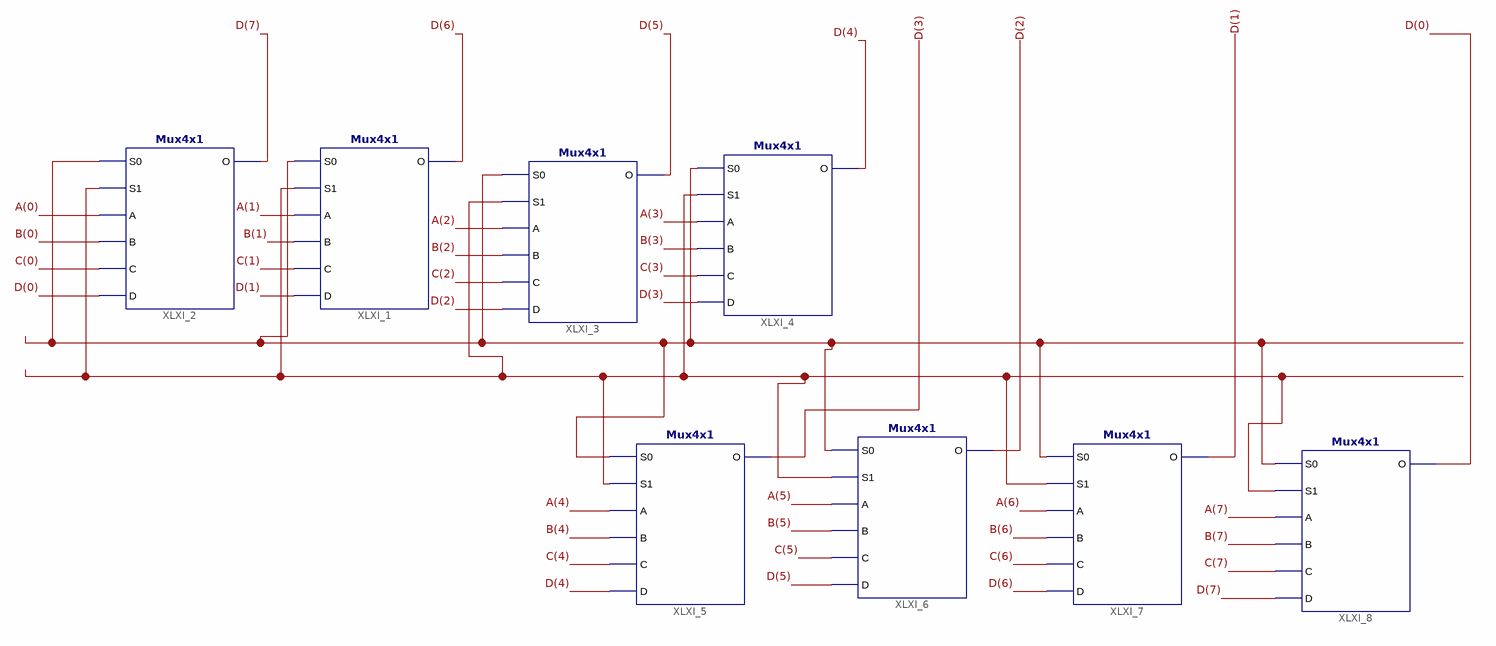
[diagram p0: schematic sheet 1]
// Xilinx ISE schematic commonbussystem.sch (artix7) as structural Verilog: 8 symbols, 0 ports
module commonbussystem (
);

  wire XLXN_25, XLXN_36;
  wire [7:0] A, B, C, D;

  Mux4x1 XLXI_1 (.S0(XLXN_25), .S1(XLXN_36), .A(A[1]), .B(B[1]), .C(C[1]), .D(D[1]), .O(D[6]));
  Mux4x1 XLXI_2 (.S0(XLXN_25), .S1(XLXN_36), .A(A[0]), .B(B[0]), .C(C[0]), .D(D[0]), .O(D[7]));
  Mux4x1 XLXI_3 (.S0(XLXN_25), .S1(XLXN_36), .A(A[2]), .B(B[2]), .C(C[2]), .D(D[2]), .O(D[5]));
  Mux4x1 XLXI_4 (.S0(XLXN_25), .S1(XLXN_36), .A(A[3]), .B(B[3]), .C(C[3]), .D(D[3]), .O(D[4]));
  Mux4x1 XLXI_5 (.S0(XLXN_25), .S1(XLXN_36), .A(A[4]), .B(B[4]), .C(C[4]), .D(D[4]), .O(D[3]));
  Mux4x1 XLXI_6 (.S0(XLXN_25), .S1(XLXN_36), .A(A[5]), .B(B[5]), .C(C[5]), .D(D[5]), .O(D[2]));
  Mux4x1 XLXI_7 (.S0(XLXN_25), .S1(XLXN_36), .A(A[6]), .B(B[6]), .C(C[6]), .D(D[6]), .O(D[1]));
  Mux4x1 XLXI_8 (.S0(XLXN_25), .S1(XLXN_36), .A(A[7]), .B(B[7]), .C(C[7]), .D(D[7]), .O(D[0]));
endmodule
